# Altium schematic sheet W25Q128JVSIQTR1_W25Q128JVSIQTR.schdoc
size 127 x 101 mm
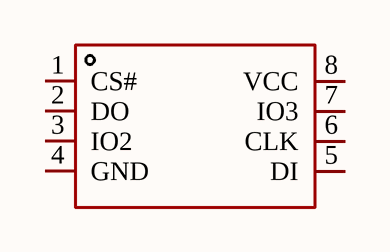
[diagram p0: W25Q128JVSIQTR1_W25Q128JVSIQTR.schdoc]

## Parts
U?  W25Q128JVSIQ  [SOIC-8_L5.3-W5.3-P1.27-LS8.0-BL]  (value not drawn)

## Nets

Not connected (* = marked no-connect by the designer): U? 1(CS#) 2(DO) 3(IO2) 4(GND) 5(DI) 6(CLK) 7(IO3) 8(VCC)

## Library data of the parts
U? = W25Q128JVSIQ: Manufacturer: Winbond(华邦); Symbol: W25Q128JVSIQTR; Add into BOM: yes; Interface: SPI; Memory Size: 128Mbit; Clock Frequency: 133MHz; Voltage - Supply: 2.7V~3.6V; Standby Supply Current: 1uA; Program / Erase Cycles: 100000次; Page Programming Time (Tpp): 3ms; Block Erase Time(tBE): 120ms@(32KB); Data Retention - TDR (Year): 20年; Device: W25Q128JVSIQ; LCSC Part Name: 编带 支持双路/四路SPI接口的3V、128Mbit 串行闪存; Supplier Part: C97521; Manufacturer Part: W25Q128JVSIQ; Supplier Footprint: SOIC-8-208mil; JLCPCB Part Class: Basic Part; Datasheet: https://item.szlcsc.com/datasheet/W25Q128JVSIQ/98729.html; Supplier: LCSC; Convert to PCB: yes; Operating Temperature: -40℃~+85℃